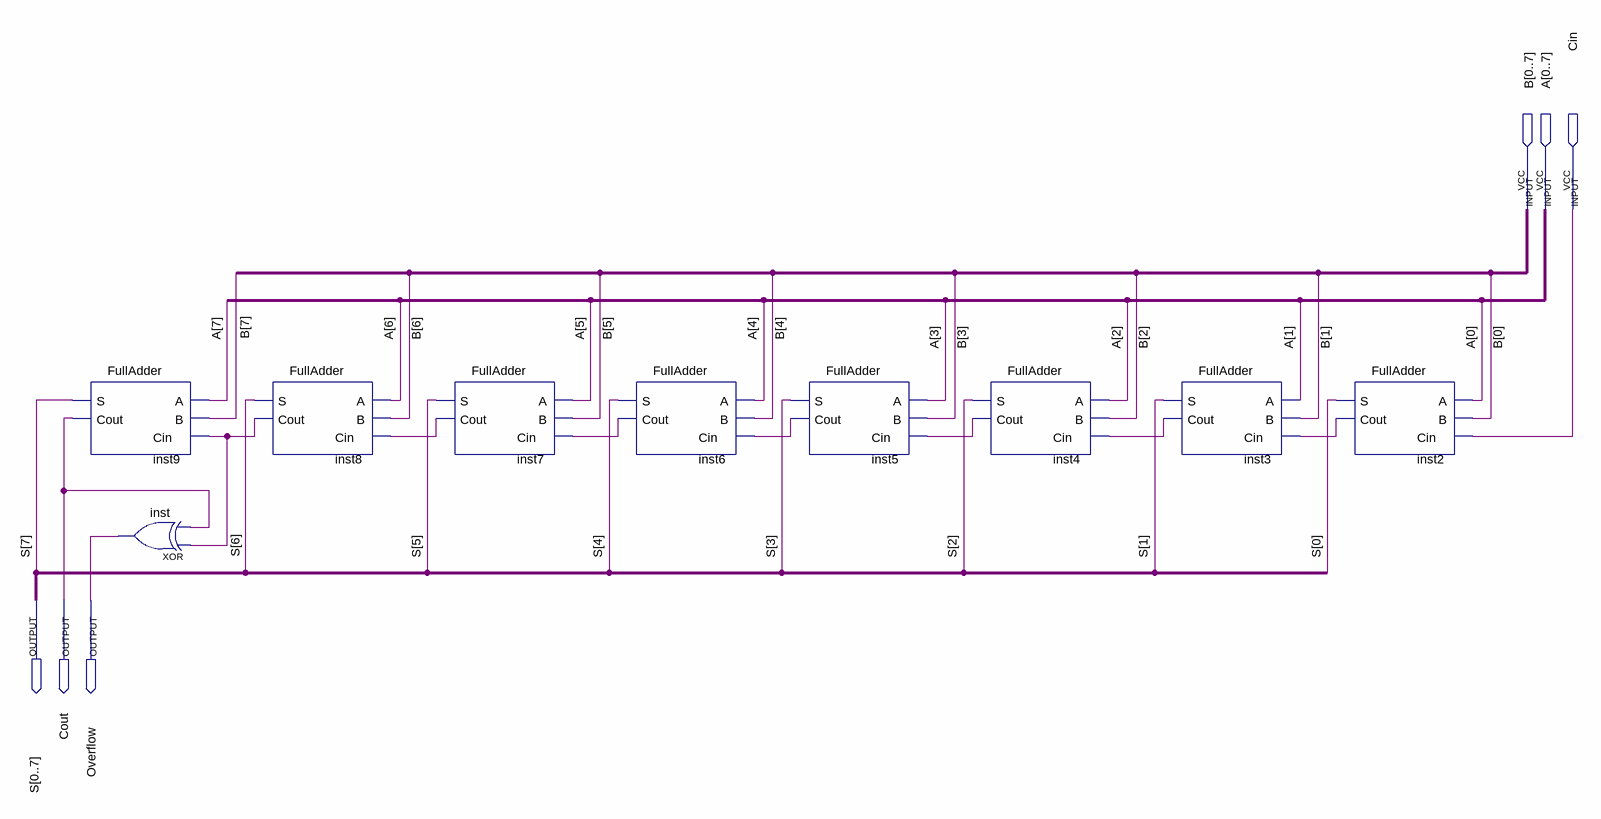
[diagram p0: schematic sheet]
// Quartus schematic FullAdder8Bits.bdf as structural Verilog: 9 symbols, 6 pins
module FullAdder8Bits (
  input  [0:7] B,
  input  [0:7] A,
  input  Cin,
  output [0:7] S,
  output Cout,
  output Overflow
);

  wire inst2_cout, inst3_cout, inst4_cout, inst5_cout, inst6_cout, inst7_cout, inst8_cout;

  FullAdder inst9 (.A(A[7]), .B(B[7]), .Cin(inst8_cout), .S(S[7]), .Cout(Cout));
  xor inst (Overflow, inst8_cout, Cout);
  FullAdder inst8 (.A(A[6]), .B(B[6]), .Cin(inst7_cout), .S(S[6]), .Cout(inst8_cout));
  FullAdder inst7 (.A(A[5]), .B(B[5]), .Cin(inst6_cout), .S(S[5]), .Cout(inst7_cout));
  FullAdder inst6 (.A(A[4]), .B(B[4]), .Cin(inst5_cout), .S(S[4]), .Cout(inst6_cout));
  FullAdder inst5 (.A(A[3]), .B(B[3]), .Cin(inst4_cout), .S(S[3]), .Cout(inst5_cout));
  FullAdder inst4 (.A(A[2]), .B(B[2]), .Cin(inst3_cout), .S(S[2]), .Cout(inst4_cout));
  FullAdder inst3 (.A(A[1]), .B(B[1]), .Cin(inst2_cout), .S(S[1]), .Cout(inst3_cout));
  FullAdder inst2 (.A(A[0]), .B(B[0]), .Cin(Cin), .S(S[0]), .Cout(inst2_cout));
endmodule
